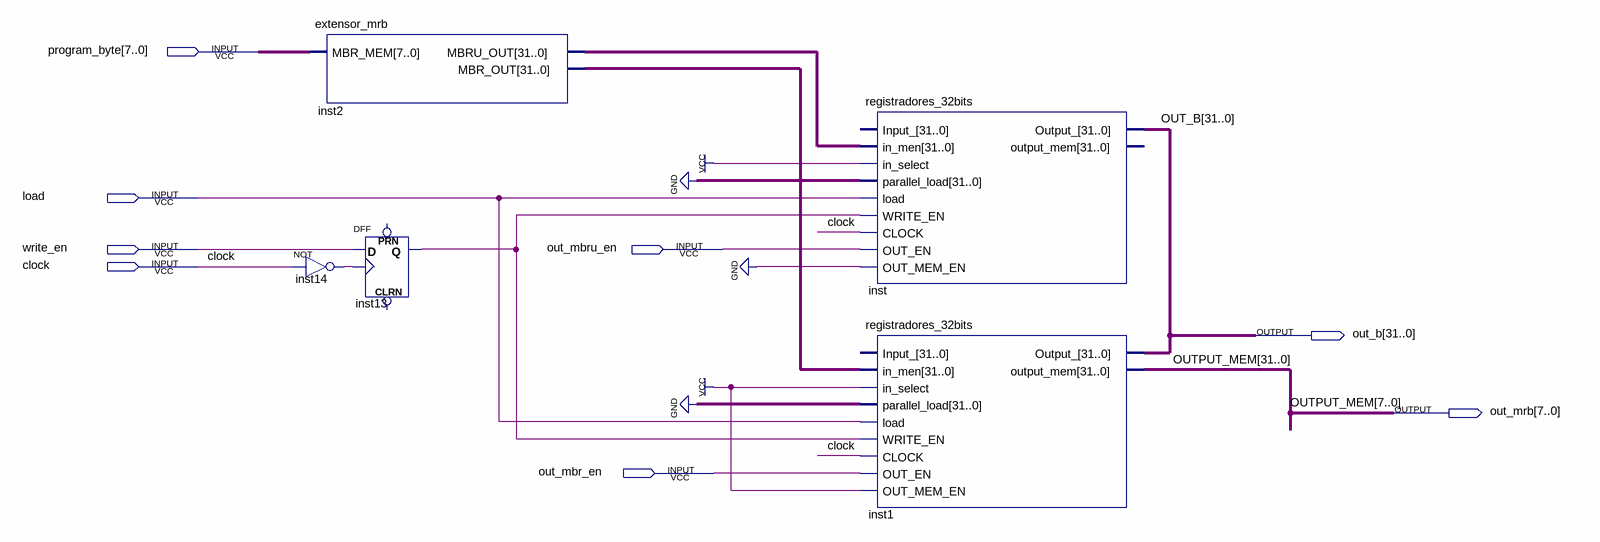
[diagram p0: schematic sheet]
// Quartus schematic MRB.bdf as structural Verilog: 5 symbols, 8 pins
module MRB (
  input  [7:0] program_byte,
  input  load,
  input  write_en,
  input  out_mbru_en,
  input  clock,
  input  out_mbr_en,
  output [31:0] out_b,
  output [7:0] out_mrb
);

  wire inst13_q, inst14_out;
  wire [31:0] inst2_mbr_out, inst2_mbru_out;
  wire [31:8] OUTPUT_MEM;

  extensor_mrb inst2 (.MBR_MEM(program_byte), .MBRU_OUT(inst2_mbru_out), .MBR_OUT(inst2_mbr_out));
  not inst14 (inst14_out, clock);
  DFF inst13 (.CLK(inst14_out), .D(write_en), .Q(inst13_q));  // open: CLRN, PRN
  registradores_32bits inst (
    .in_men(inst2_mbru_out), .in_select(1'b1), .parallel_load({32{1'b0}}), .load(load), .WRITE_EN(inst13_q),
    .CLOCK(clock), .OUT_EN(out_mbru_en), .OUT_MEM_EN(1'b0), .Output_(out_b));  // open: Input_, output_mem
  registradores_32bits inst1 (
    .in_men(inst2_mbr_out), .in_select(1'b1), .parallel_load({32{1'b0}}), .load(load), .WRITE_EN(inst13_q),
    .CLOCK(clock), .OUT_EN(out_mbr_en), .OUT_MEM_EN(1'b1), .Output_(out_b), .output_mem({OUTPUT_MEM, out_mrb}));  // open: Input_

  // Other names for the same wires on the sheet: OUTPUT_MEM[7:0] = out_mrb
endmodule
